# Altium project PCB_Project_Simple_Sync.PrjPcb
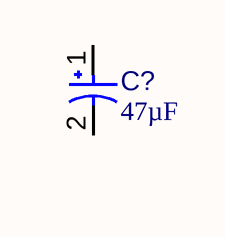
[diagram p0: Sheet1.SchDoc]
CAGE_CODE: ?????; CONTRACT_NUMBER: <CONTRACT NO>; DOC_NO_ASSY_DWG: <ASSY DWG NO>; DOC_NO_BOM: <BOM DOC NO>; DOC_NO_FAB_DWG: <FAB DWG NO>; DOC_NO_SCH_DWG: <SCH DWG NO>; PCB_2_DEC_TOL: +/-.01; PCB_3_DEC_TOL: +/-.010; PCB_ANG_TOL: +/-1/2; PCB_ASSEMBLY_NO: <PCB ASSY NO>; PCB_CHECKER: - -----; PCB_CHECKER_APP_DATE: --/--/----; PCB_DESIGNER: - -----; PCB_DESIGNER_APP_DATE: --/--/----; PCB_DWG_NO: <PCB DWG NO>; PCB_ENGINEER: - -----; PCB_ENGINEER_APP_DATE: --/--/----; PCB_PART_NUMBER: <PCB PN>; PCB_REV: A; SCH_REV: A
1 sheet, 1 parts. Net scope: global (net labels, ports and power ports of the same name join across sheets).
Board file: PCB1.PcbDoc

## Sheet Sheet1.SchDoc
size 431 x 279 mm; SheetNumber: 1; SheetTotal: 1; ENG_APP_DATE: --/--/--; DSN_APP_DATE: --/--/--; CHK_APP_DATE: --/--/--

### Parts
C?  value 47µF  [CAPPR65-350-1150X800X1250]  (hidden comment: ECA-2AM470)

### Nets

Not connected (* = marked no-connect by the designer): C? 1 2

### Notes on the sheet
- 8
- 7
- 6
- 5
- 4
- 3
- DWG. NO.
- REV.
- SHT.
- 2
- 1
- THIS DOCUMENT AND THE DATA DISCLOSED HEREIN OR HEREWITH IS THE PROPERTY OF ALTIUM LIMITED AND MAY BE FREELY DISTRIBUTED IN WHOLE. NO RIGHTS ARE RESERVED OR EXPRESS OR IMPLIED WARANTEE GIVEN.
- REVISION
- DESCRIPTION
- DATE
- APPROVED
- F
- E
- D
- C
- B
- ENG:
- APPROVALS
- PROJECT
- SUITE 200
- 2175 SALK AVENUE
- CARLSBAD, CA 92008
- A
- DSN:
- CHK:
- REFERENCE DOCUMENTS
- PROJECT REVISION:
- TITLE
- DOCUMENT REVISION:
- DESIGN ITEM:
- USA
- BOM:
- FAB DWG:
- PCB DWG:
- ASSY DWG:
- SCALE:
- SIZE
- CAGE CODE
- FILE NAME
- DWG NO.
- SHEET
- OF
- REV

### Library data of the parts
C? = CMP-001-00036-5: Aluminum Electrolytic Capacitor, 47 uF, +/- 20%, 100 V, -40 to 85 degC, 2-Pin THD, RoHS, Bulk; Manufacturer: Panasonic; Ripple Current: 180mA; Voltage Rating: 100V; Package Quantity: 200; Datasheet Version: Mar-16; Packaging: Bulk; Datasheet URL: http://industrial.panasonic.com/cdbs/www-data/pdf/RDF0000/ABA0000C1047.pdf; Manufacturer URL: http://www.panasonic.com/; Tolerance: 20%; Case/Package: Radial; Capacitor Type: Electrolytic; Lead Pitch: 3.5mm; Ripple Current (AC): 180mA; Pins: 2; RoHS Compliant: True; Mounting Technology: TH; Max Operating Temperature: 85°C; Package Reference: CAPPR65-350-1150X800X1250; Diameter: 8mm; Package Description: 2-Pin Radial Lead, Dia 8 mm, Height 12.5 mm; Min Operating Temperature: -40°C